# EAGLE design Soldering Iron Controls v0.4 (EAGLE 7.6.0)
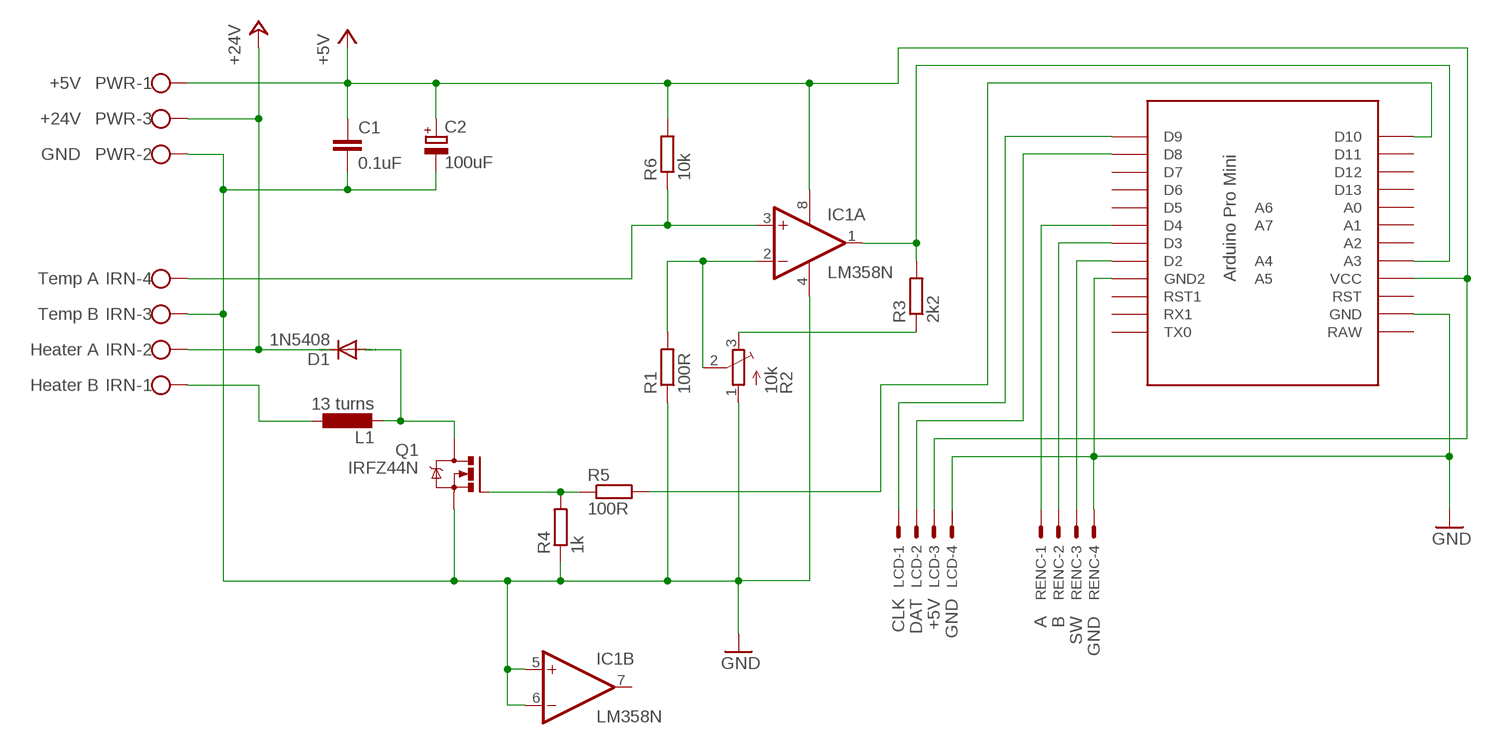
[diagram p0: schematic, sheet 1]

## Parts
C1  0.1uF  C-EU025-024X044  [C025-024X044]
C2  100uF  CPOL-EUE5-6  [E5-6]
D1  1N5408  DIODE-DO27-15  [DO27-15]
IC1  LM358N  [DIL08]
IRN  W237-4  [W237-4]
L1  13 turns  L-EUTJ3-U1  [TJ3-U1]
LCD  22-05-7048-04  [7395-04]
PWR  W237-103  [W237-103]
Q1  IRFZ44N  [TO220BV]
R1  100R  R-EU_0207/7  [0207/7@1]
R2  10k  TRIM_EU-RM-065  [RM-065]
R3  2k2  R-EU_0207/7  [0207/7@1]
R4  1k  R-EU_0207/7  [0207/7@1]
R5  100R  R-EU_0207/7  [0207/7@1]
R6  10k  R-EU_0207/7  [0207/7@1]
RENC  22-05-7048-04  [7395-04]
U$1  PRO-MINI-2X  [PRO-MINI-2X]

## Nets
+5V: C1.1 C2.+ IC1.8(P:V+) LCD.3 PWR.1 R6.2 U$1.VCC
+24V: D1.C IRN.2 PWR.3
GND: C1.2 C2.- IC1.4(P:V-) IC1.5(B:+IN) IC1.6(B:-IN) IRN.3 LCD.4 PWR.2 Q1.S R1.1 R2.1(A) R4.1 RENC.4 U$1.GND U$1.GND1(GND2)
N$1: R2.3(E) R3.1
N$2: IRN.1 L1.1
N$3: D1.A L1.2 Q1.D
N$4: IC1.2(A:-IN) R1.2 R2.2(S)
N$5: R5.2 U$1.D10
N$6: IC1.1(A:OUT) R3.2 U$1.A3
N$7: RENC.3 U$1.D2
N$8: RENC.2 U$1.D3
N$9: RENC.1 U$1.D4
N$10: IC1.3(A:+IN) IRN.4 R6.1
N$11: Q1.G R4.2 R5.1
N$12: LCD.2 U$1.D8
N$13: LCD.1 U$1.D9
Unconnected: IC1.7(B:OUT) U$1.A0 U$1.A1 U$1.A2 U$1.A4 U$1.A5 U$1.A6 U$1.A7 U$1.D5 U$1.D6 U$1.D7 U$1.D11 U$1.D12 U$1.D13 U$1.RAW U$1.RST U$1.RST1 U$1.RX1 U$1.TX0

## Notes on the sheet
- +5V
- +24V
- GND
- Temp A
- Temp B
- Heater A
- Heater B
- CLK | DAT | +5V | GND
- A | B | SW | GND

## Library data of the parts
C1 = MD:C-EU: CAPACITOR, European symbol
C2 = MD:CPOL-EU: POLARIZED CAPACITOR, European symbol
D1 = diode:DIODE-: DIODE
IC1 = MD:LM358: OP AMP also LM158; LM258; LM2904 Source: http://cache.national.com/ds/LM/LM158.pdf
IRN = con-wago-500:W237-4: WAGO SCREW CLAMP; OC_FARNELL: unknown; OC_NEWARK: unknown
L1 = MD:L-EU: INDUCTOR, European symbol
LCD RENC = con-molex:22-?-04: CONNECTOR wire to board 2.54 mm (.1 inch) pitch header; OC_FARNELL: unknown; OC_NEWARK: unknown
PWR = con-wago-500:W237-103: WAGO SCREW CLAMP; MPN: 237-103; OC_FARNELL: unknown; OC_NEWARK: 18M7116
Q1 = MD:IRFZ44N: N-Channel HEXFET® Power MOSFET Logic Level AUTOMOTIVE MOSFET Source: http://www.irf.com/product-info/datasheets/data/irlz44zpbf.pdf
R1 R3-R6 = MD:R-EU_: RESISTOR, European symbol
R2 = MD:TRIM_EU-: POTENTIOMETER
U$1 = Arduino-clone:PRO-MINI-2X

## Board
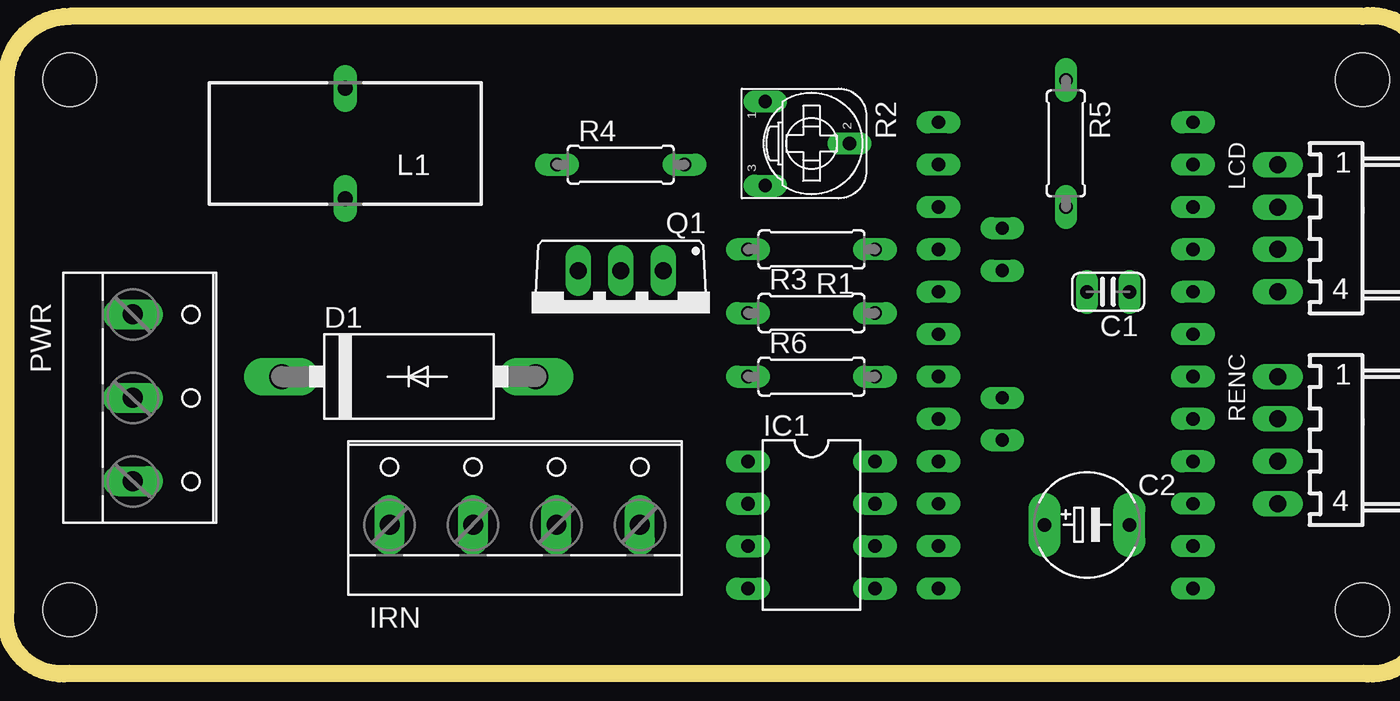
[diagram p1: board, top side]
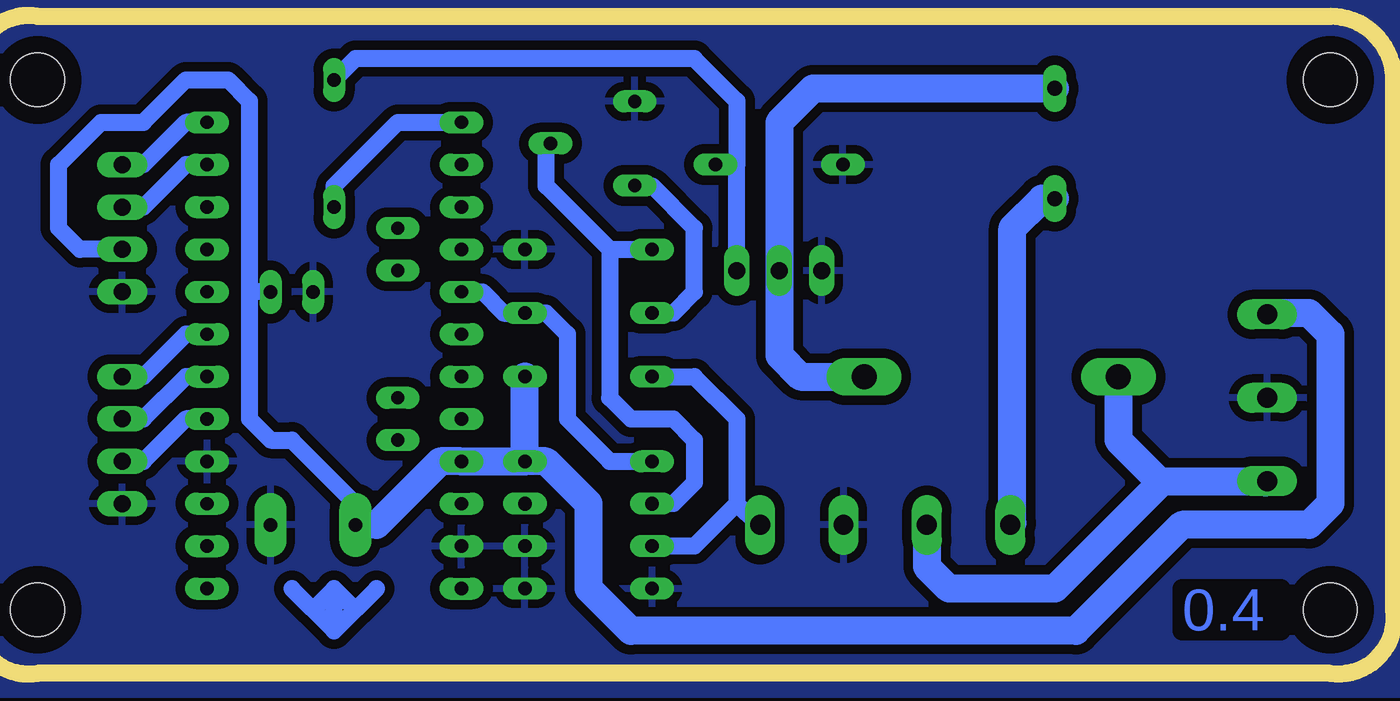
[diagram p2: board, bottom side, seen from below]

No outline drawn. Coordinates in mm, seen from the top.
Copper layers (1*16): Top 0.035mm / dielectric 1.5mm / Bottom 0.035mm
Design rules "pcb-milling": minimum track width 10mil, minimum drill 24mil, track to track 10mil, track to pad 25mil, pad to pad 25mil, via to via 10mil, smd to smd 8mil, copper to edge 40mil, drill to drill 8mil, minimum pad ring 10mil, minimum via ring 8mil, stop-mask expansion 4mil, vias tented up to drill 0mil, thermal gap 20mil
Holes 3.2 mm at 81.28,3.81 81.28,35.56 3.81,35.56 3.81,3.81
Milling: 8 lines

### Footprints (pad centres in the part's own frame; a part is rotated, then mirrored left to right if it is on the bottom)
C025-024X044 = drill 0.813 long: 1 -1.27,0; 2 1.27,0
E5-6 = drill 0.813 pad 1.905 long: + -2.54,0; - 2.54,0
DO27-15 = drill 1.499 long: A 7.62,0; C -7.62,0
DIL08 = drill 0.813 pad 1.27 long: 1 -3.81,-3.81; 2 -1.27,-3.81; 3 1.27,-3.81; 4 3.81,-3.81; 5 3.81,3.81; 6 1.27,3.81; 7 -1.27,3.81; 8 -3.81,3.81
W237-4 = drill 1.194 long: 1 -7.5,-1.27; 2 -2.5,-1.27; 3 2.5,-1.27; 4 7.5,-1.27
TJ3-U1 = drill 0.9 long: 1 -3.3,0; 2 3.3,0
7395-04 = drill 1.016 long: 1 3.81,0; 2 1.27,0; 3 -1.27,0; 4 -3.81,0
W237-103 = drill 1.194 long: 1 -5,-1.29; 2 0,-1.29; 3 5,-1.29
TO220BV = drill 1.016 long: D 0,-2.54; G -2.54,-2.54; S 2.54,-2.54
0207/7@1 = drill 0.813 long: 1 -3.81,0; 2 3.81,0
RM-065 = drill 0.8 long: 1 -2.52,-2.77; 2 0,2.27; 3 2.52,-2.77
PRO-MINI-2X = drill 0.8 long: A0 6.35,2.54; A1 6.35,0; A2 6.35,-2.54; A3 6.35,-5.08; A4 2.54,1.27; A5 2.54,3.81; A6 2.54,-8.89; A7 2.54,-6.35; D2 -8.89,2.54; D3 -8.89,0; D4 -8.89,-2.54; D5 -8.89,-5.08; D6 -8.89,-7.62; D7 -8.89,-10.16; D8 -8.89,-12.7; D9 -8.89,-15.24; D10 6.35,-15.24; D11 6.35,-12.7; D12 6.35,-10.16; D13 6.35,-7.62; GND 6.35,10.16; GND1 -8.89,5.08; RAW 6.35,12.7; RST 6.35,7.62; RST1 -8.89,7.62; RX1 -8.89,10.16; TX0 -8.89,12.7; VCC 6.35,5.08

### Placement (x,y rotation side)
C1  66.04,22.86 180 top
C2  64.77,8.89 0 top
D1  24.13,17.78 0 top
IC1  48.26,8.89 270 top
IRN  30.48,10.16 0 top
L1  20.32,31.75 90 top
LCD  76.2,26.67 90 top
PWR  8.89,16.51 270 top
Q1  36.83,21.59 180 top
R1  48.26,25.4 180 top
R2  48.26,31.75 270 top
R3  48.26,21.59 0 top
R4  36.83,30.48 0 top
R5  63.5,31.75 270 top
R6  48.26,17.78 0 top
RENC  76.2,13.97 90 top
U$1  62.23,17.78 180 top

### Tracks (layer width: path | path; a pad name or v marks a point on that pad's centre or on a via)
+5V
  Bottom 1.016: LCD.3 78.74,25.4 80.01,26.67 80.01,30.48 77.47,33.02 74.93,33.02 72.39,35.56 69.85,35.56 68.58,34.29 68.58,22.86 | 68.58,22.86 68.58,15.24 67.31,13.97 66.04,13.97 62.23,10.16 C2.+ | C1.1 68.58,22.86
  Bottom 1.676: IC1.8 U$1.VCC 57.15,12.7 60.96,8.89 C2.+ | IC1.8 R6.2 | IC1.8 50.8,12.7 48.26,10.16 48.26,5.08 45.72,2.54 19.05,2.54 12.7,8.89 5.08,8.89 3.81,10.16 3.81,20.32 5.08,21.59 7.52,21.59 PWR.1
+24V
  Bottom 1.676: IRN.2 27.98,6.39 26.67,5.08 20.32,5.08 13.97,11.43 | 7.68,11.43 PWR.3 13.89,11.51 13.97,11.43 | D1.C 16.51,13.97 13.97,11.43
GND
  pour Bottom (isolate 0.575): -1.27,40.64 86.36,40.64 86.36,-1.27 -1.27,-1.27
N$1
  Bottom 1.016: R3.1 43.18,21.59 41.91,22.86 41.91,26.67 44.45,29.21 45.47,29.21 R2.3
N$2
  Bottom 1.676: IRN.1 22.86,9.01 22.86,26.67 21.08,28.45 L1.1
N$3
  Bottom 1.676: L1.2 34.8,35.05 36.83,33.02 Q1.D 36.83,19.05 35.56,17.78 D1.A
N$4
  Bottom 1.016: IC1.2 43.18,10.16 41.91,11.43 41.91,13.97 43.18,15.24 45.72,15.24 46.99,16.51 46.99,25.4 | 46.99,25.4 R1.2 | 46.99,25.4 50.8,29.21 50.8,31.48 R2.2
N$5
  Bottom 1.016: R5.2 63.5,29.21 59.69,33.02 U$1.D10
N$6
  Bottom 1.016: U$1.A3 54.61,22.86 53.34,21.59 R3.2 50.8,21.59 49.53,20.32 49.53,15.24 46.99,12.7 IC1.1
N$7
  Bottom 1.016: U$1.D2 72.39,15.24 74.93,12.7 RENC.3
N$8
  Bottom 1.016: U$1.D3 72.39,17.78 74.93,15.24 RENC.2
N$9
  Bottom 1.016: U$1.D4 72.39,20.32 74.93,17.78 RENC.1
N$10
  Bottom 1.016: 39.37,10.16 39.37,15.24 41.91,17.78 R6.1 | 39.37,10.16 41.91,7.62 IC1.3 | IRN.4 38.1,8.89 39.37,10.16
N$11
  Bottom 1.016: R5.1 62.23,36.83 41.91,36.83 39.37,34.29 39.37,30.48 | 39.37,30.48 R4.2 | Q1.G 39.37,30.48
N$12
  Bottom 1.016: U$1.D8 72.39,30.48 74.93,27.94 LCD.2
N$13
  Bottom 1.016: U$1.D9 72.39,33.02 74.93,30.48 LCD.1
N$14
  Bottom 0.406: 66.04,5.08 64.77,3.81 63.5,2.54 62.23,3.81 60.96,5.08
  Bottom 1.016: 63.5,2.54 63.5,5.08 | 62.23,3.81 63.5,5.08 | 64.77,3.81 63.5,5.08 | 60.96,5.08 63.5,2.54 | 63.5,2.54 66.04,5.08

### Text on the board
Bottom: 0.4